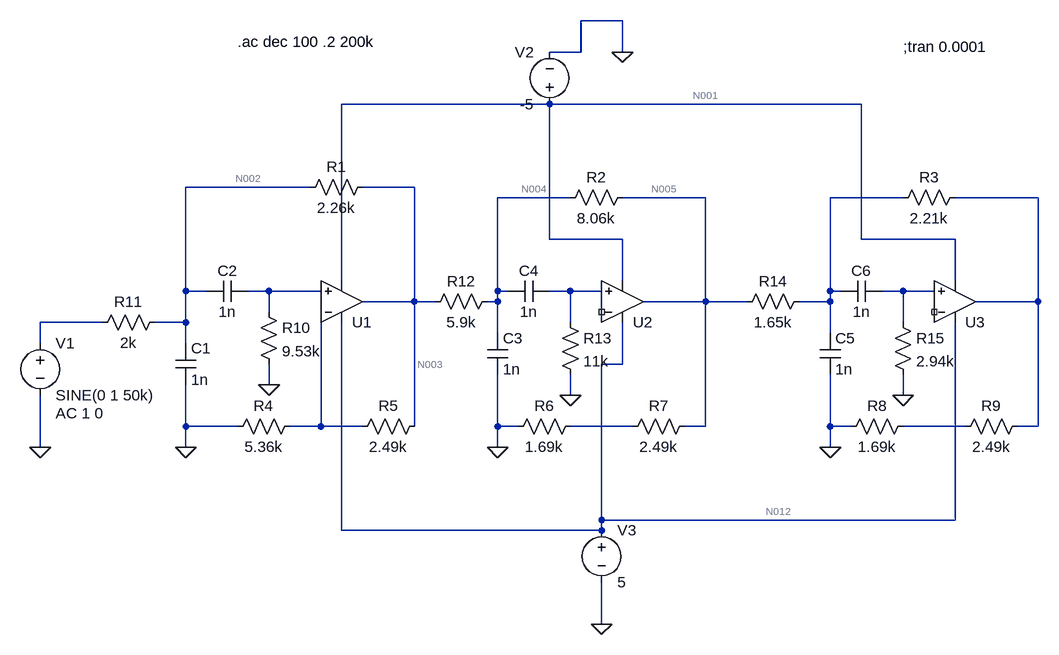
[diagram p0: schematic BandpassFilter6thorderBessel(WORKS BUT GOES DOWN TO 10kHz).asc]
BandpassFilter6thorderBessel(WORKS BUT GOES DOWN TO 10kHz).asc, the LTspice schematic file:
Version 4
SHEET 1 1096 680
WIRE 448 -272 384 -272
WIRE 384 -224 384 -272
WIRE 384 -224 336 -224
WIRE 448 -224 448 -272
WIRE 336 -144 16 -144
WIRE 816 -144 336 -144
WIRE -32 -16 -224 -16
WIRE 128 -16 48 -16
WIRE 368 0 256 0
WIRE 576 0 448 0
WIRE 880 0 768 0
WIRE 1088 0 960 0
WIRE 336 64 336 -144
WIRE 448 64 336 64
WIRE 816 64 816 -144
WIRE 960 64 816 64
WIRE 16 128 16 -144
WIRE 448 128 448 64
WIRE 960 128 960 64
WIRE -224 144 -224 -16
WIRE -192 144 -224 144
WIRE -96 144 -128 144
WIRE -16 144 -96 144
WIRE 256 144 256 0
WIRE 272 144 256 144
WIRE 368 144 336 144
WIRE 416 144 368 144
WIRE 768 144 768 0
WIRE 784 144 768 144
WIRE 880 144 848 144
WIRE 928 144 880 144
WIRE 128 160 128 -16
WIRE 128 160 48 160
WIRE 160 160 128 160
WIRE 256 160 256 144
WIRE 256 160 240 160
WIRE 576 160 576 0
WIRE 576 160 480 160
WIRE 640 160 576 160
WIRE 768 160 768 144
WIRE 768 160 720 160
WIRE 1088 160 1088 0
WIRE 1088 160 992 160
WIRE -96 176 -96 144
WIRE -352 192 -448 192
WIRE -224 192 -224 144
WIRE -224 192 -272 192
WIRE 368 192 368 144
WIRE 880 192 880 144
WIRE 256 208 256 160
WIRE 768 208 768 160
WIRE -448 224 -448 192
WIRE -224 224 -224 192
WIRE 448 256 448 192
WIRE 448 256 416 256
WIRE -96 288 -96 256
WIRE 368 304 368 272
WIRE 880 304 880 272
WIRE -224 352 -224 288
WIRE -144 352 -224 352
WIRE -16 352 -16 176
WIRE -16 352 -64 352
WIRE 48 352 -16 352
WIRE 128 352 128 160
WIRE 256 352 256 272
WIRE 288 352 256 352
WIRE 464 352 368 352
WIRE 576 352 576 160
WIRE 576 352 544 352
WIRE 768 352 768 272
WIRE 800 352 768 352
WIRE 976 352 880 352
WIRE 1088 352 1088 160
WIRE 1088 352 1056 352
WIRE -448 384 -448 304
WIRE -224 384 -224 352
WIRE 256 384 256 352
WIRE 768 384 768 352
WIRE 416 496 416 256
WIRE 960 496 960 192
WIRE 960 496 416 496
WIRE 16 512 16 192
WIRE 416 512 416 496
WIRE 416 512 16 512
WIRE 416 656 416 592
FLAG -96 288 0
FLAG -224 384 0
FLAG -448 384 0
FLAG 448 -224 0
FLAG 416 656 0
FLAG 256 384 0
FLAG 368 304 0
FLAG 768 384 0
FLAG 880 304 0
SYMBOL res 64 -32 R90
WINDOW 0 0 56 VBottom 2
WINDOW 3 32 56 VTop 2
SYMATTR InstName R1
SYMATTR Value 2.26k
SYMBOL res 464 -16 R90
WINDOW 0 0 56 VBottom 2
WINDOW 3 32 56 VTop 2
SYMATTR InstName R2
SYMATTR Value 8.06k
SYMBOL res -48 336 R90
WINDOW 0 0 56 VBottom 2
WINDOW 3 32 56 VTop 2
SYMATTR InstName R4
SYMATTR Value 5.36k
SYMBOL res 144 336 R90
WINDOW 0 0 56 VBottom 2
WINDOW 3 32 56 VTop 2
SYMATTR InstName R5
SYMATTR Value 2.49k
SYMBOL res 384 336 R90
WINDOW 0 0 56 VBottom 2
WINDOW 3 32 56 VTop 2
SYMATTR InstName R6
SYMATTR Value 1.69k
SYMBOL res 560 336 R90
WINDOW 0 0 56 VBottom 2
WINDOW 3 32 56 VTop 2
SYMATTR InstName R7
SYMATTR Value 2.49k
SYMBOL cap -240 224 R0
SYMATTR InstName C1
SYMATTR Value 1n
SYMBOL cap -128 128 R90
WINDOW 0 0 32 VBottom 2
WINDOW 3 32 32 VTop 2
SYMATTR InstName C2
SYMATTR Value 1n
SYMBOL res -112 160 R0
SYMATTR InstName R10
SYMATTR Value 9.53k
SYMBOL res -256 176 R90
WINDOW 0 0 56 VBottom 2
WINDOW 3 32 56 VTop 2
SYMATTR InstName R11
SYMATTR Value 2k
SYMBOL voltage -448 208 R0
WINDOW 123 24 124 Left 2
WINDOW 39 0 0 Left 0
SYMATTR Value2 AC 1 0
SYMATTR InstName V1
SYMATTR Value SINE(0 1 50k)
SYMBOL voltage 336 -128 R180
WINDOW 0 24 96 Left 2
WINDOW 3 24 16 Left 2
SYMATTR InstName V2
SYMATTR Value -5
SYMBOL voltage 416 496 R0
SYMATTR InstName V3
SYMATTR Value 5
SYMBOL res 256 144 R90
WINDOW 0 0 56 VBottom 2
WINDOW 3 32 56 VTop 2
SYMATTR InstName R12
SYMATTR Value 5.9k
SYMBOL cap 240 208 R0
SYMATTR InstName C3
SYMATTR Value 1n
SYMBOL cap 336 128 R90
WINDOW 0 0 32 VBottom 2
WINDOW 3 32 32 VTop 2
SYMATTR InstName C4
SYMATTR Value 1n
SYMBOL OpAmps\\UniversalOpAmp 16 160 M180
SYMATTR InstName U1
SYMBOL OpAmps\\UniversalOpAmp 448 160 M180
SYMATTR InstName U2
SYMBOL res 352 176 R0
SYMATTR InstName R13
SYMATTR Value 11k
SYMBOL res 976 -16 R90
WINDOW 0 0 56 VBottom 2
WINDOW 3 32 56 VTop 2
SYMATTR InstName R3
SYMATTR Value 2.21k
SYMBOL res 896 336 R90
WINDOW 0 0 56 VBottom 2
WINDOW 3 32 56 VTop 2
SYMATTR InstName R8
SYMATTR Value 1.69k
SYMBOL res 1072 336 R90
WINDOW 0 0 56 VBottom 2
WINDOW 3 32 56 VTop 2
SYMATTR InstName R9
SYMATTR Value 2.49k
SYMBOL res 736 144 R90
WINDOW 0 0 56 VBottom 2
WINDOW 3 32 56 VTop 2
SYMATTR InstName R14
SYMATTR Value 1.65k
SYMBOL cap 752 208 R0
SYMATTR InstName C5
SYMATTR Value 1n
SYMBOL cap 848 128 R90
WINDOW 0 0 32 VBottom 2
WINDOW 3 32 32 VTop 2
SYMATTR InstName C6
SYMATTR Value 1n
SYMBOL OpAmps\\UniversalOpAmp 960 160 M180
SYMATTR InstName U3
SYMBOL res 864 176 R0
SYMATTR InstName R15
SYMATTR Value 2.94k
TEXT -144 -240 Left 2 !.ac dec 100 .2 200k
TEXT 880 -232 Left 2 !;tran 0.0001

The netlist it stands for:
* BandpassFilter6thorderBessel(WORKS BUT GOES DOWN TO 10kHz).asc
R1 N003 N002 2.26k
R2 N005 N004 8.06k
R4 N013 0 5.36k
R5 N003 N013 2.49k
R6 N014 0 1.69k
R7 N005 N014 2.49k
C1 N002 0 1n
C2 N008 N002 1n
R10 N008 0 9.53k
R11 N002 N011 2k
V1 N011 0 SINE(0 1 50k) AC 1 0
V2 N001 0 -5
V3 N012 0 5
R12 N004 N003 5.9k
C3 N004 0 1n
C4 N009 N004 1n
XU1 N008 N013 N012 N001 N003 level1 Avol=1Meg GBW=10Meg Vos=0 En=0 Enk=0 In=0 Ink=0 Rin=500Meg  ; pins In+ In- V+ V- OUT
XU2 N009 NC_01 N012 N001 N005 level1 Avol=1Meg GBW=10Meg Vos=0 En=0 Enk=0 In=0 Ink=0 Rin=500Meg  ; pins In+ In- V+ V- OUT
R13 N009 0 11k
R3 N007 N006 2.21k
R8 N015 0 1.69k
R9 N007 N015 2.49k
R14 N006 N005 1.65k
C5 N006 0 1n
C6 N010 N006 1n
XU3 N010 NC_02 N012 N001 N007 level1 Avol=1Meg GBW=10Meg Vos=0 En=0 Enk=0 In=0 Ink=0 Rin=500Meg  ; pins In+ In- V+ V- OUT
R15 N010 0 2.94k
.ac dec 100 .2 200k
;tran 0.0001
.lib UniversalOpAmp1.lib
.backanno
.end

* Results of the author's LTspice run, read from the files saved beside the schematic
* Operating Point, zero values left out:
*   V(n001) = -5 V
*   V(n012) = 5 V
*   I(V3) = -30 nA
*   I(V2) = 30 nA
*   Ix(u1:3) = 10 nA
*   Ix(u1:4) = -10 nA
*   Ix(u2:3) = 10 nA
*   Ix(u2:4) = -10 nA
*   Ix(u3:3) = 10 nA
*   Ix(u3:4) = -10 nA
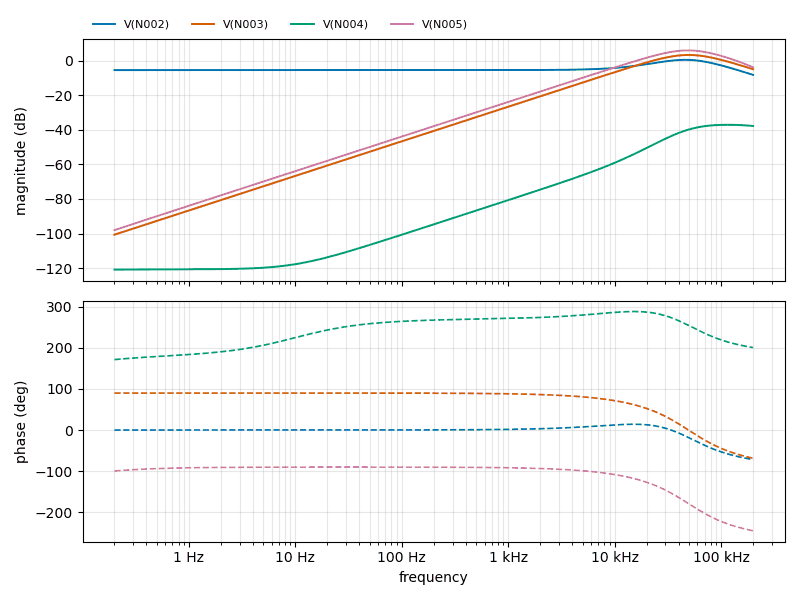
[diagram p1: AC Analysis of BandpassFilter6thorderBessel(WORKS BUT GOES DOWN TO 10kHz).asc, plotted from the saved traces]
* AC Analysis, 1 run:
*   V(N002): -5.51 dB at 200 mHz, -8.26 dB at 200 kHz, peak 0.42 dB at 45.82 kHz, 3 dB below the peak at 17.69 kHz and 97.57 kHz
*   V(N003): -100.63 dB at 200 mHz, -4.98 dB at 200 kHz, peak 3.24 dB at 50.24 kHz, 3 dB below the peak at 23.95 kHz and 103 kHz
*   V(N004): -120.82 dB at 200 mHz, -37.82 dB at 200 kHz, peak -37.11 dB at 115.1 kHz, 3 dB below the peak at 48.03 kHz
*   V(N005): -98.01 dB at 200 mHz, -3.87 dB at 200 kHz, peak 5.87 dB at 49.09 kHz, 3 dB below the peak at 23.67 kHz and 98.39 kHz